# Altium schematic sheet UART_BUS.SchDoc
size A4
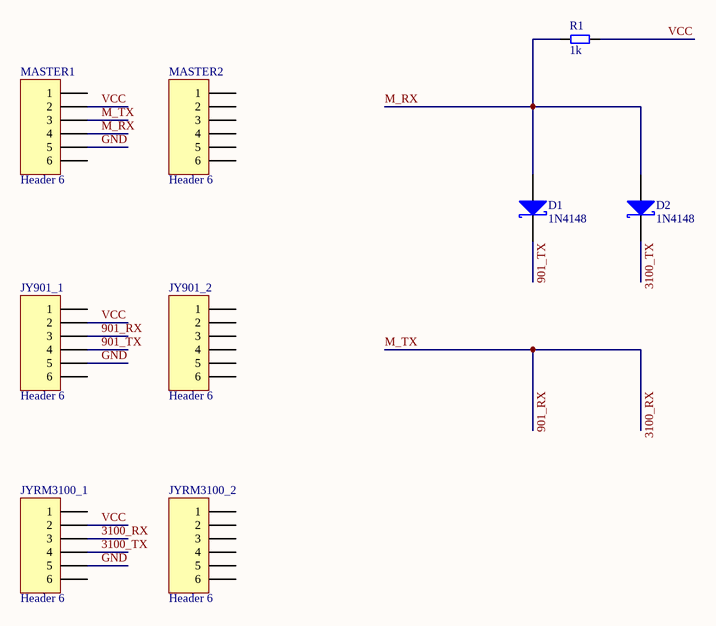
[diagram p0: UART_BUS.SchDoc]

## Parts
D1  1N4148  [1N4148_S]
D2  1N4148  [1N4148_S]
JY901_1  Device Name  [HDR1X6]  (value not drawn)
JY901_2  Device Name  [HDR1X6]  (value not drawn)
JYRM3100_1  Device Name  [HDR1X6]  (value not drawn)
JYRM3100_2  Device Name  [HDR1X6]  (value not drawn)
MASTER1  Device Name  [HDR1X6]  (value not drawn)
MASTER2  Device Name  [HDR1X6]  (value not drawn)
R1  Sch Name: 1k  [RES 0603]  (hidden comment: xxR/Precision/Footprint)

## Nets
901_TX: D1.2(K) JY901_1.4
3100_RX: JY901_1.3 JYRM3100_1.3 MASTER1.3  [also labelled 901_RX, M_TX]
3100_TX: D2.2(K) JYRM3100_1.4
GND: JY901_1.5 JYRM3100_1.5 MASTER1.5
M_RX: D1.1(A) D2.1(A) MASTER1.4 R1.1
VCC: JY901_1.2 JYRM3100_1.2 MASTER1.2 R1.2

Not connected (* = marked no-connect by the designer): JY901_1 1 6; JY901_2 1 2 3 4 5 6; JYRM3100_1 1 6; JYRM3100_2 1 2 3 4 5 6; MASTER1 1 6; MASTER2 1 2 3 4 5 6

## Library data of the parts
D1 D2 = D Schottky: Schottky Diode; Published: 8-Jun-2000; LatestRevisionDate: 17-Jul-2002; LatestRevisionNote: Re-released for DXP Platform.; PackageReference: SMB; Publisher: Altium Limited; Code_JEDEC: DO-214-AA
JY901_1 JY901_2 JYRM3100_1 JYRM3100_2 MASTER1 MASTER2 = Header 6: Header, 6-Pin; Manufacture: Device Name; Sch Name: Header 6
R1 = Resistor Chip: Manufacture: xxR/Precision/Footprint